# EAGLE design On Board Computer (EAGLE 9.6.2)

## Sheet 1 of 2
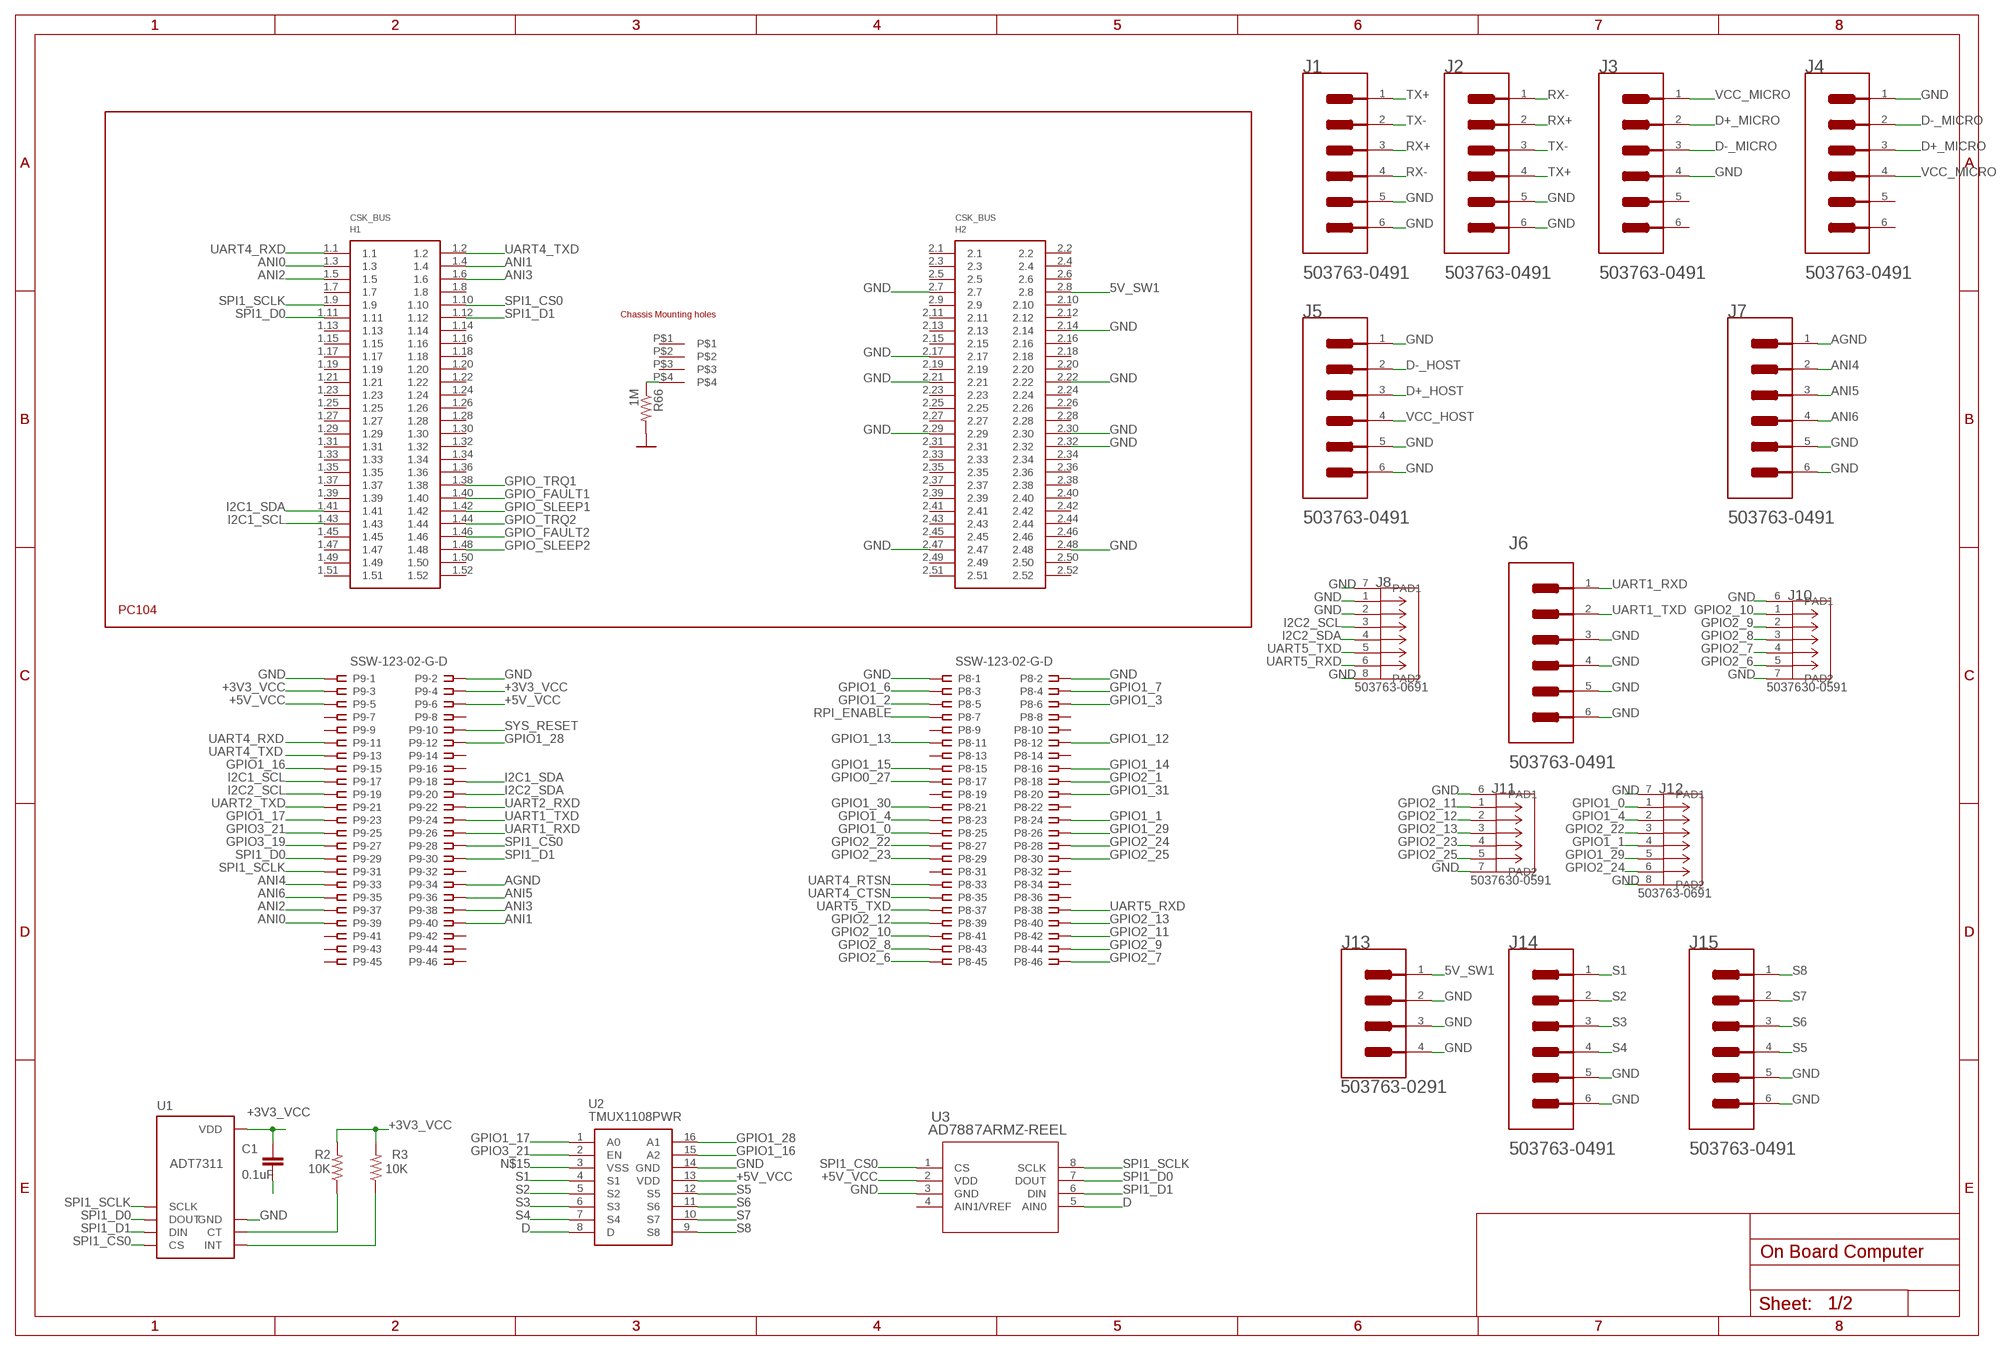
[diagram p0: schematic, sheet 1]

### Parts
C1  0.1uF  CAP0805  [0805]
H1  PC104_WCONN  [PC104_WCONN]
J1  MOLEX_503763-0491MOLEX_503763-0491_0_0  [MOLEX_503763-0491_0]
J2  MOLEX_503763-0491MOLEX_503763-0491_0_0  [MOLEX_503763-0491_0]
J3  MOLEX_503763-0491MOLEX_503763-0491_0_0  [MOLEX_503763-0491_0]
J4  MOLEX_503763-0491MOLEX_503763-0491_0_0  [MOLEX_503763-0491_0]
J5  MOLEX_503763-0491MOLEX_503763-0491_0_0  [MOLEX_503763-0491_0]
J6  MOLEX_503763-0491MOLEX_503763-0491_0_0  [MOLEX_503763-0491_0]
J7  MOLEX_503763-0491MOLEX_503763-0491_0_0  [MOLEX_503763-0491_0]
J8  503763-0691  [CONN_503763-0691_MOL]
J10  503763-0591  [CONN_5037630591_MOL]
J11  503763-0591  [CONN_5037630591_MOL]
J12  503763-0691  [CONN_503763-0691_MOL]
J13  MOLEX_503763-0291MOLEX_503763-0291_0_0  [MOLEX_503763-0291_0]
J14  MOLEX_503763-0491MOLEX_503763-0491_0_0  [MOLEX_503763-0491_0]
J15  MOLEX_503763-0491MOLEX_503763-0491_0_0  [MOLEX_503763-0491_0]
P8  SSW-123-02-G-D  [SSW-123-02-G-D]
P9  SSW-123-02-G-D  [SSW-123-02-G-D]
R2  10K  RESISTOR0805-RES  [0805]
R3  10K  RESISTOR0805-RES  [0805]
R66  1M  RESISTOR0805-RES  [0805]
U1  ADT7311  [SOIC-8]
U2  TMUX1108PWR  [SOP65P640X120-16N]
U3  AD7887ARMZ-REEL  [RM_8_ADI]

### Nets
5V_SW1: H1.2.8 J13.1 ; also sheet 2
+3V3_VCC: C1.1 P9.3 P9.4 R2.2 R3.2 U1.8(VDD) ; also sheet 2
+5V_VCC: P9.5 P9.6 U2.13(VDD) U3.2(VDD)
AGND: J7.1 P9.34
ANI0: H1.1.3 P9.39
ANI1: H1.1.4 P9.40
ANI2: H1.1.5 P9.37
ANI3: H1.1.6 P9.38
ANI4: J7.2 P9.33
ANI5: J7.3 P9.36
ANI6: J7.4 P9.35
D: U2.8(D) U3.5(AIN0)
D+_HOST: J5.3 ; also sheet 2
D+_MICRO: J3.2 J4.3
D-_HOST: J5.2 ; also sheet 2
D-_MICRO: J3.3 J4.2
GND: C1.2 H1.2.7 H1.2.14 H1.2.17 H1.2.21 H1.2.22 H1.2.29 H1.2.30 H1.2.32 H1.2.47 H1.2.48 J1.5(MNT_1) J1.6(MNT_2) J2.5(MNT_1) J2.6(MNT_2) J3.4 J4.1 J5.1 J5.5(MNT_1) J5.6(MNT_2) J6.3 J6.4 J6.5(MNT_1) J6.6(MNT_2) J7.5(MNT_1) J7.6(MNT_2) J8.1 J8.2 J8.7(PAD1) J8.8(PAD2) J10.6(PAD1) J10.7(PAD2) J11.6(PAD1) J11.7(PAD2) J12.7(PAD1) J12.8(PAD2) J13.2 J13.3(MNT_1) J13.4(MNT_2) J14.5(MNT_1) J14.6(MNT_2) J15.5(MNT_1) J15.6(MNT_2) P8.1 P8.2 P9.1 P9.2 R66.2 U1.7(GND) U2.14(GND) U3.3(GND) ; also sheet 2
GPIO0_27: P8.17
GPIO1_0: J12.1 P8.25
GPIO1_1: J12.4 P8.24
GPIO1_2: P8.5
GPIO1_3: P8.6
GPIO1_4: J12.2 P8.23
GPIO1_6: P8.3
GPIO1_7: P8.4
GPIO1_12: P8.12
GPIO1_13: P8.11
GPIO1_14: P8.16
GPIO1_15: P8.15
GPIO1_16: P9.15 U2.15(A2)
GPIO1_17: P9.23 U2.1(A0)
GPIO1_28: P9.12 U2.16(A1)
GPIO1_29: J12.5 P8.26
GPIO1_30: P8.21
GPIO1_31: P8.20
GPIO2_1: P8.18
GPIO2_6: J10.5 P8.45
GPIO2_7: J10.4 P8.46
GPIO2_8: J10.3 P8.43
GPIO2_9: J10.2 P8.44
GPIO2_10: J10.1 P8.41
GPIO2_11: J11.1 P8.42
GPIO2_12: J11.2 P8.39
GPIO2_13: J11.3 P8.40
GPIO2_22: J12.3 P8.27
GPIO2_23: J11.4 P8.29
GPIO2_24: J12.6 P8.28
GPIO2_25: J11.5 P8.30
GPIO3_19: P9.27
GPIO3_21: P9.25 U2.2(EN)
GPIO_FAULT1: H1.1.40
GPIO_FAULT2: H1.1.46
GPIO_SLEEP1: H1.1.42
GPIO_SLEEP2: H1.1.48
GPIO_TRQ1: H1.1.38
GPIO_TRQ2: H1.1.44
I2C1_SCL: H1.1.43 P9.17
I2C1_SDA: H1.1.41 P9.18
I2C2_SCL: J8.3 P9.19
I2C2_SDA: J8.4 P9.20
N$15: U2.3(VSS)
N$94: H1.P$4 R66.1
RPI_ENABLE: P8.7 ; also sheet 2
RX+: J1.3 J2.2
RX-: J1.4 J2.1
S1: J14.1 U2.4(S1)
S2: J14.2 U2.5(S2)
S3: J14.3 U2.6(S3)
S4: J14.4 U2.7(S4)
S5: J15.4 U2.12(S5)
S6: J15.3 U2.11(S6)
S7: J15.2 U2.10(S7)
S8: J15.1 U2.9(S8)
SPI1_CS0: H1.1.10 P9.28 U1.4(CS) U3.1(CS)
SPI1_D0: H1.1.11 P9.29 U1.2(DOUT) U3.7(DOUT)
SPI1_D1: H1.1.12 P9.30 U1.3(DIN) U3.6(DIN)
SPI1_SCLK: H1.1.9 P9.31 U1.1(SCLK) U3.8(SCLK)
SYS_RESET: P9.10
TX+: J1.1 J2.4
TX-: J1.2 J2.3
U11_CT: R2.1 U1.6(CT)
U11_INT: R3.1 U1.5(INT)
UART1_RXD: J6.1 P9.26
UART1_TXD: J6.2 P9.24
UART2_RXD: P9.22 ; also sheet 2
UART2_TXD: P9.21 ; also sheet 2
UART4_CTSN: P8.35
UART4_RTSN: P8.33
UART4_RXD: H1.1.1 P9.11
UART4_TXD: H1.1.2 P9.13
UART5_RXD: J8.6 P8.38
UART5_TXD: J8.5 P8.37
VCC_HOST: J5.4 ; also sheet 2
VCC_MICRO: J3.1 J4.4
Unconnected: H1.1.7 H1.1.8 H1.1.13 H1.1.14 H1.1.15 H1.1.16 H1.1.17 H1.1.18 H1.1.19 H1.1.20 H1.1.21 H1.1.22 H1.1.23 H1.1.24 H1.1.25 H1.1.26 H1.1.27 H1.1.28 H1.1.29 H1.1.30 H1.1.31 H1.1.32 H1.1.33 H1.1.34 H1.1.35 H1.1.36 H1.1.37 H1.1.39 H1.1.45 H1.1.47 H1.1.49 H1.1.50 H1.1.51 H1.1.52 H1.2.1 H1.2.2 H1.2.3 H1.2.4 H1.2.5 H1.2.6 H1.2.9 H1.2.10 H1.2.11 H1.2.12 H1.2.13 H1.2.15 H1.2.16 H1.2.18 H1.2.19 H1.2.20 H1.2.23 H1.2.24 H1.2.25 H1.2.26 H1.2.27 H1.2.28 H1.2.31 H1.2.33 H1.2.34 H1.2.35 H1.2.36 H1.2.37 H1.2.38 H1.2.39 H1.2.40 H1.2.41 H1.2.42 H1.2.43 H1.2.44 H1.2.45 H1.2.46 H1.2.49 H1.2.50 H1.2.51 H1.2.52 H1.P$1 H1.P$2 H1.P$3 J3.5(MNT_1) J3.6(MNT_2) J4.5(MNT_1) J4.6(MNT_2) P8.8 P8.9 P8.10 P8.13 P8.14 P8.19 P8.22 P8.31 P8.32 P8.34 P8.36 P9.7 P9.8 P9.9 P9.14 P9.16 P9.32 P9.41 P9.42 P9.43 P9.44 P9.45 P9.46 U3.4(AIN1/VREF)

## Sheet 2 of 2
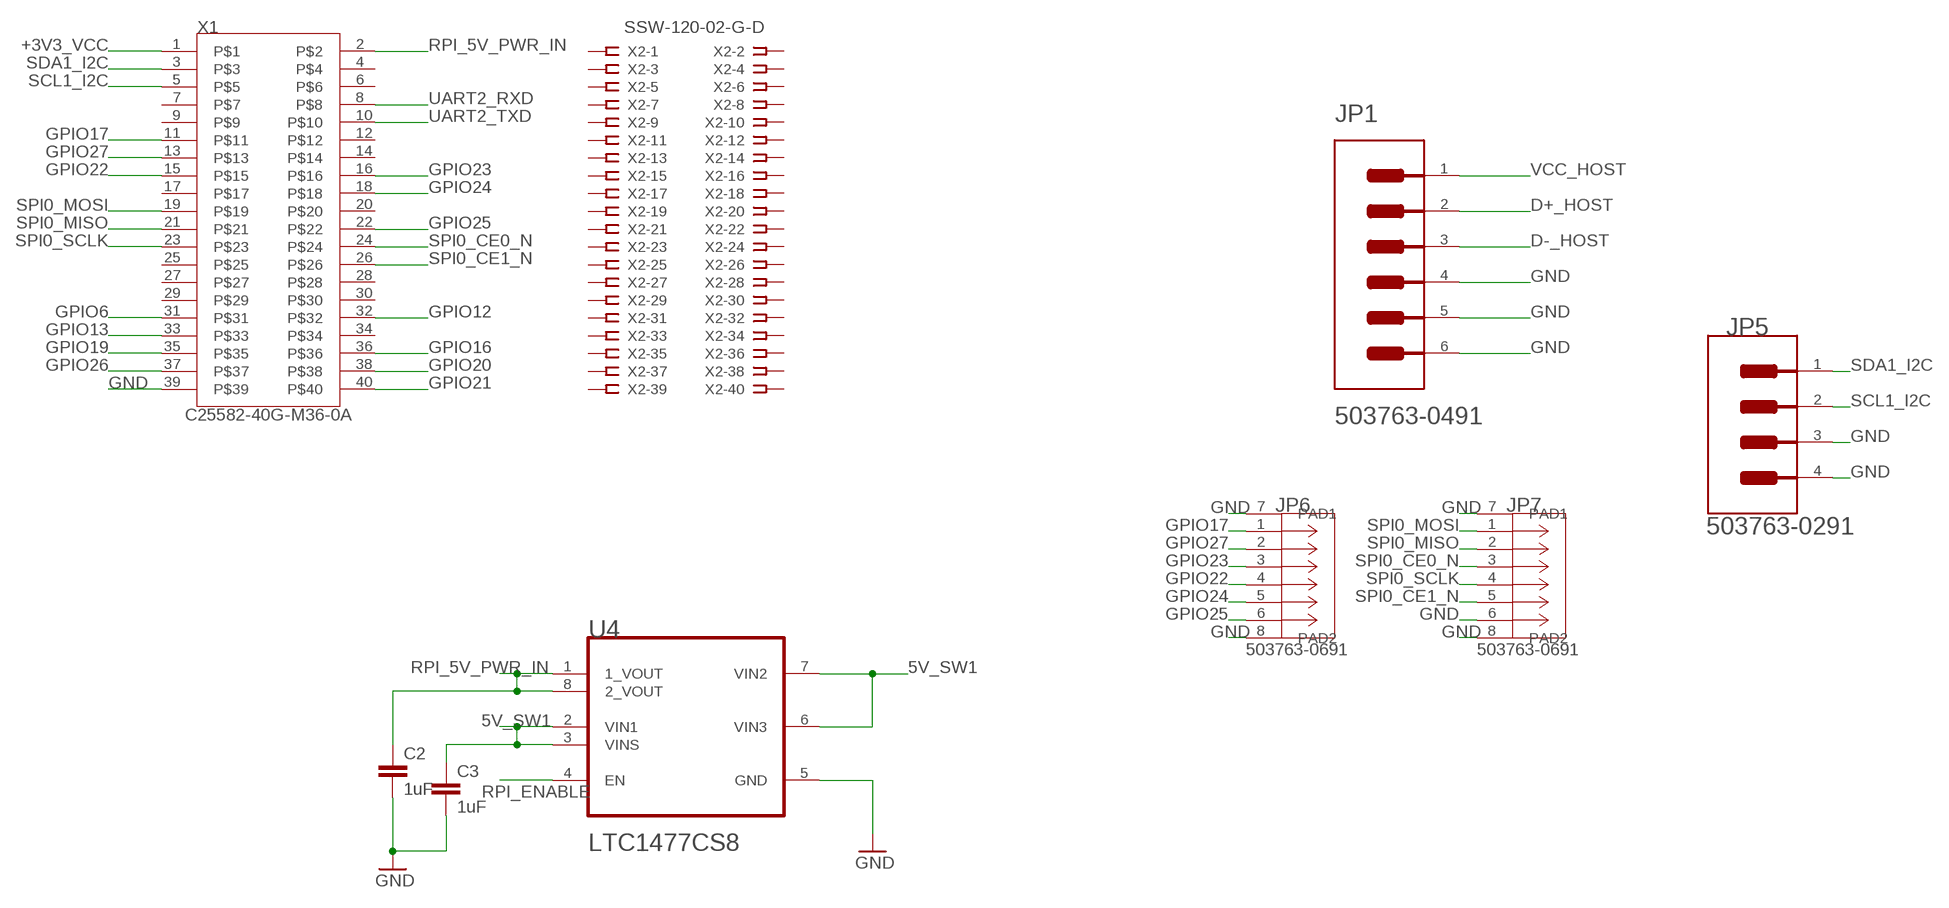
[diagram p1: schematic, sheet 2]

### Parts
C2  1uF  CAP0805  [0805]
C3  1uF  CAP0805  [0805]
JP1  MOLEX_503763-0491MOLEX_503763-0491_0_0  [MOLEX_503763-0491_0]
JP5  MOLEX_503763-0291MOLEX_503763-0291_0_0  [MOLEX_503763-0291_0]
JP6  503763-0691  [CONN_503763-0691_MOL]
JP7  503763-0691  [CONN_503763-0691_MOL]
U4  LTC1477CS8LINEAR_TECHNOLOGY_LTC1477CS8_0_2  [LINEAR_TECHNOLOGY_LTC1477CS8_2]
X1  C25582-40G-M36-0A  [ADAFRUIT_C25582-40G-M36-0A_0]
X2  SSW-120-02-G-D  [SSW-120-02-G-D]

### Nets
5V_SW1: C3.1 U4.2(VIN1) U4.3(VINS) U4.6(VIN3) U4.7(VIN2) ; also sheet 1
+3V3_VCC: X1.1 ; also sheet 1
D+_HOST: JP1.2 ; also sheet 1
D-_HOST: JP1.3 ; also sheet 1
GND: C2.2 C3.2 JP1.4 JP1.5(MNT_1) JP1.6(MNT_2) JP5.3(MNT_1) JP5.4(MNT_2) JP6.7(PAD1) JP6.8(PAD2) JP7.6 JP7.7(PAD1) JP7.8(PAD2) U4.5(GND) X1.39 ; also sheet 1
GPIO6: X1.31
GPIO12: X1.32
GPIO13: X1.33
GPIO16: X1.36
GPIO17: JP6.1 X1.11
GPIO19: X1.35
GPIO20: X1.38
GPIO21: X1.40
GPIO22: JP6.4 X1.15
GPIO23: JP6.3 X1.16
GPIO24: JP6.5 X1.18
GPIO25: JP6.6 X1.22
GPIO26: X1.37
GPIO27: JP6.2 X1.13
RPI_5V_PWR_IN: C2.1 U4.1(1_VOUT) U4.8(2_VOUT) X1.2
RPI_ENABLE: U4.4(EN) ; also sheet 1
SCL1_I2C: JP5.2 X1.5
SDA1_I2C: JP5.1 X1.3
SPI0_CE0_N: JP7.3 X1.24
SPI0_CE1_N: JP7.5 X1.26
SPI0_MISO: JP7.2 X1.21
SPI0_MOSI: JP7.1 X1.19
SPI0_SCLK: JP7.4 X1.23
UART2_RXD: X1.8 ; also sheet 1
UART2_TXD: X1.10 ; also sheet 1
VCC_HOST: JP1.1 ; also sheet 1
Unconnected: X1.4 X1.6 X1.7 X1.9 X1.12 X1.14 X1.17 X1.20 X1.25 X1.27 X1.28 X1.29 X1.30 X1.34 X2.1 X2.2 X2.3 X2.4 X2.5 X2.6 X2.7 X2.8 X2.9 X2.10 X2.11 X2.12 X2.13 X2.14 X2.15 X2.16 X2.17 X2.18 X2.19 X2.20 X2.21 X2.22 X2.23 X2.24 X2.25 X2.26 X2.27 X2.28 X2.29 X2.30 X2.31 X2.32 X2.33 X2.34 X2.35 X2.36 X2.37 X2.38 X2.39 X2.40

## Library data of the parts
C1-C3 = HSFL_Main_Library:CAP: Capacitor Standard 0603 ceramic capacitor, and 0.1" leaded capacitor.
H1 = HSFL_Main_Library:PC104_WCONN
J1-J7 J14 J15 JP1 = Molex - 503763-0491:MOLEX_503763-0491: Wire-To-Board Connector, Pico-Lock 503763 Series, Surface Mount, Header, 4 Contacts, 1 mm; AUTOMOTIVE: No; CENTROID_NOT_SPECIFIED: No; CONN_GENDER: Male; CONN_ORIENTATION: Right Angle; CONTACT_MATERIAL: Gold,Nickel; CURRENT_RATING: 1.5A; DATASHEET: https://www.molex.com/webdocs/datasheets/pdf/en-us/5037630491_PCB_HEADERS.pdf; DEVICE_CLASS_L1: Connectors; DEVICE_CLASS_L2: Headers and Wire Housings; DEVICE_CLASS_L3: unset; DIGIKEY_DESCRIPTION: CONN HEADER 1MM R/A 4CKT; DIGIKEY_PART_NUMBER: WM10655CT-ND; FOOTPRINT_URL: https://www.molex.com/pdm_docs/sd/5037630491_sd.pdf; FOOTPRINT_VARIANT_NAME_0: Recommended_Land_Pattern; HEIGHT: 1.7mm; LEAD_FREE: Yes; MF: Molex; MFG_PACKAGE_IDENT: 503763-0491; MFG_PACKAGE_IDENT_DATE: 0; MFG_PACKAGE_IDENT_REV: 0; MOUSER_PART_NUMBER: 538-503763-0491; MPN: 503763-0491; NUMBER_OF_CONTACTS: 4; NUMBER_OF_ROWS: 1; PACKAGE: HDR4; PITCH: 1mm; PREFIX: J; ROHS: Yes; TEMPERATURE_RANGE_HIGH: +105°C; TEMPERATURE_RANGE_LOW: -40°C; VERIFICATION_VERSION: 0.0.0.1; VOLTAGE_RATING: 150V
J8 J12 JP6 JP7 = Improved Molex 503763-0691:503763-0691; BUILT_BY: EMA_Cory; COPYRIGHT: Copyright (C) 2018 Accelerated Designs. All rights reserved; DATASHEET: https://www.digikey.com/products/en?keywords=503763-0691; MANUFACTURER_PART_NUMBER: 503763-0691; SOURCELIBRARY: Molex_2020-01-22; VENDOR: Molex Connector Corporation
J10 J11 = Improved Molex 503763-0591:503763-0591; BUILT_BY: EMA_Cory; COPYRIGHT: Copyright (C) 2018 Accelerated Designs. All rights reserved; DATASHEET: https://www.molex.com/pdm_docs/sd/5037630591_sd.pdf; MANUFACTURER_PART_NUMBER: 503763-0591; SOURCELIBRARY: Add_to_database_2020-12-14; VENDOR: Molex Connector Corporation
J13 JP5 = Molex - 503763-0291:MOLEX_503763-0291: 2 Positions Header Connector 0.039" (1.00mm) Surface Mount, Right Angle Gold; CENTROID_NOT_SPECIFIED: No; DATASHEET: http://www.molex.com/pdm_docs/sd/5037630291_sd.pdf; DIGIKEY_DESCRIPTION: CONN HEADER 1MM R/A 2CKT; DIGIKEY_PART_NUMBER: WM10654CT-ND; LEAD_FREE: yes; MF: Molex; MOUSER_PART_NUMBER: 538-503763-0291; MPN: 503763-0291; PACKAGE: HDR02; PREFIX: J; ROHS: yes; TEMPERATURE_RANGE_HIGH: +105°C; TEMPERATURE_RANGE_LOW: -40°C
P8 P9 = con-samtec:SSW-123-02-G: THROUGH-HOLE .025" SQ POST SOCKET Source: Samtec SSW.pdf; MF: Samtec Inc.; MPN: SSW-123-02-G-D; OC_FARNELL: unknown; OC_NEWARK: 11P9690
R2 R3 R66 = HSFL_Main_Library:RESISTOR: Resistor Basic schematic elements and footprints for 0603, 1206, and PTH resistors.
U1 = HSFL_Main_Library:ADT7311: The ADT7311 is a high accuracy digital temperature sensor in a narrow 8-lead SOIC package. It contains a band gap temperature reference and a 16-bit ADC to monitor and digitize the temperature to a 0.0078°C resolution. The ADC resolution, by default, is set to 13 bits (0.0625°C). The ADC resolution is a user programmable mode that can be changed through the serial interface. br> The ADT7311 is guaranteed to operate over supply voltages from 2.7 V to 5.5 V. Operating at 3.3 V, the average supply current is typically 210 μA. The ADT7311 has a shutdown mode that powers down the device and offers a shutdown current of typically 2 μA. The ADT7311 is rated for operation over the −40°C to +150°C temperature range. br> The CT pin is an open-drain output that becomes active when the temperature exceeds a programmable critical temperature limit. The default critical temperature limit is 147°C. The INT pin is also an open-drain output that becomes active when the temperature exceeds a programmable limit. The INT and CT pins can operate in either comparator or interrupt mode.
U2 = SamacSys_Parts:TMUX1108PWR: Analog Switch ICs 5V / +/-2.5V, 8:1, low-leakage precision multiplexer 16-TSSOP -40 to 125 Source: Datasheet <http://www.ti.com/lit/ds/symlink/tmux1108.pdf>; DESCRIPTION: Analog Switch ICs 5V / +/-2.5V, 8:1, low-leakage precision multiplexer 16-TSSOP -40 to 125; HEIGHT: 1.2mm; MANUFACTURER_NAME: Texas Instruments; MANUFACTURER_PART_NUMBER: TMUX1108PWR; MOUSER_PART_NUMBER: 595-TMUX1108PWR; MOUSER_PRICE-STOCK: https://www.mouser.co.uk/ProductDetail/Texas-Instruments/TMUX1108PWR?qs=PqoDHHvF6486MXIgK4oQ5g%3D%3D
U3 = Personal:AD7887ARMZ-REEL; BUILT_BY: EMA_UL_Team; MANUFACTURER_PART_NUMBER: AD7887ARMZ-REEL; SOURCELIBRARY: Analog_2012-01-01_5; VENDOR: Analog Devices Inc
U4 = Artemis:LTC1477CS8: LT-LTC1477-S8-8; CIIVA_IDS: 1432281; COMPONENT_LINK_1_DESCRIPTION: Manufacturer URL; COMPONENT_LINK_1_URL: http://www.linear.com/; COMPONENT_LINK_3_DESCRIPTION: Package Specification; COMPONENT_LINK_3_URL: http://cds.linear.com/docs/en/packaging/05081610_G_SO8.pdf; DATASHEET: http://cds.linear.com/docs/en/datasheet/lt1477.pdf; FOOTPRINT_VARIANT_NAME_0: Level C; FOOTPRINT_VARIANT_NAME_1: Level B; FOOTPRINT_VARIANT_NAME_2: Level A; IMPORTED: yes; IMPORTED_FROM: vault; IMPORT_TS: 1521843574; MF: Linear Technology; MOUNTING_TECHNOLOGY: Surface Mount; MPN: LTC1477CS8; PACKAGE: S8-8; PACKAGE_DESCRIPTION: 8-Pin Plastic Small Outline (Narrow .150 Inch), Body 4.9 x 3.9 mm, Pitch 1.27 mm; PACKAGE_VERSION: Rev. G, 03/2012; PREFIX: U; RELEASE_DATE: 1377817843; ROHS: No; VAULT_GUID: 635B2D7C-EC07-409E-A57F-666E02CD64AC; VAULT_REVISION: 6B8B57C2-2CB3-4970-A31A-1EB58B636423
X1 = Adafruit - C25582-40G-M36-0A:C25582-40G-M36-0A
X2 = con-samtec:SSW-120-02-G: THROUGH-HOLE .025" SQ POST SOCKET Source: Samtec SSW.pdf; MF: Samtec Inc.; MPN: SSW-120-02-G-D; OC_FARNELL: unknown; OC_NEWARK: 11P9639

## Board
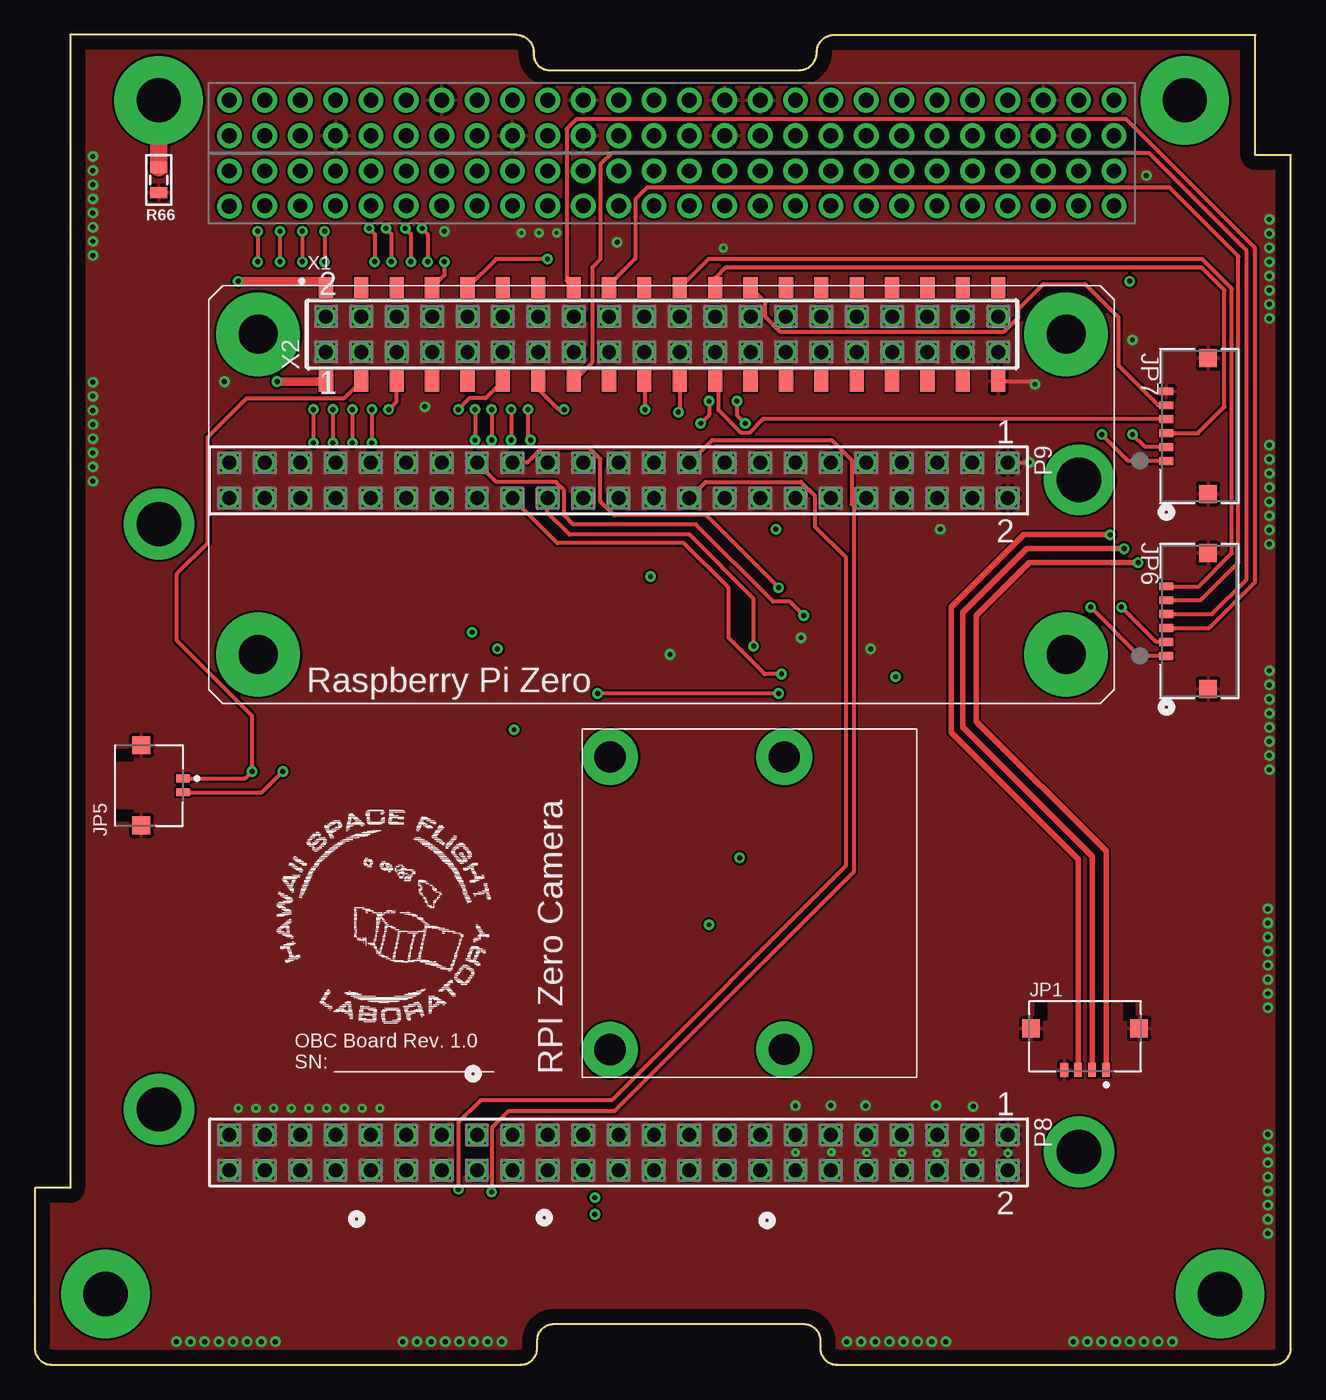
[diagram p2: board, top side]
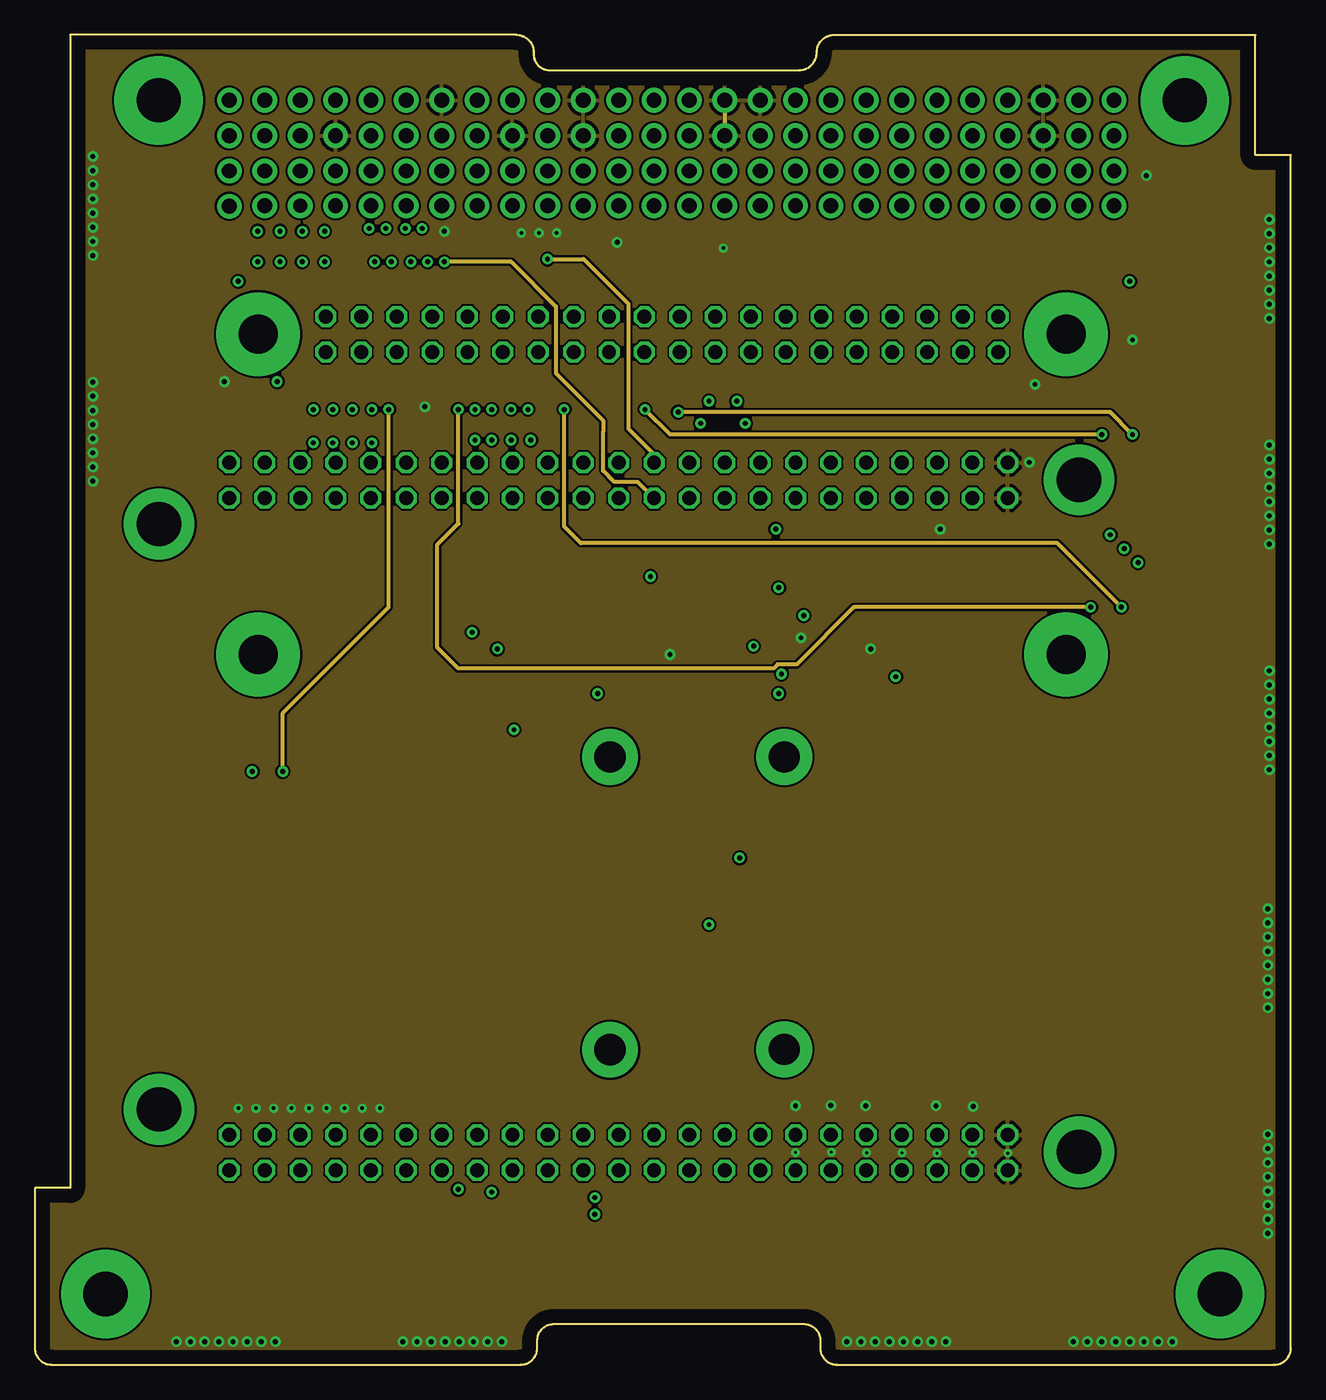
[diagram p3: board, inner layer Route2]
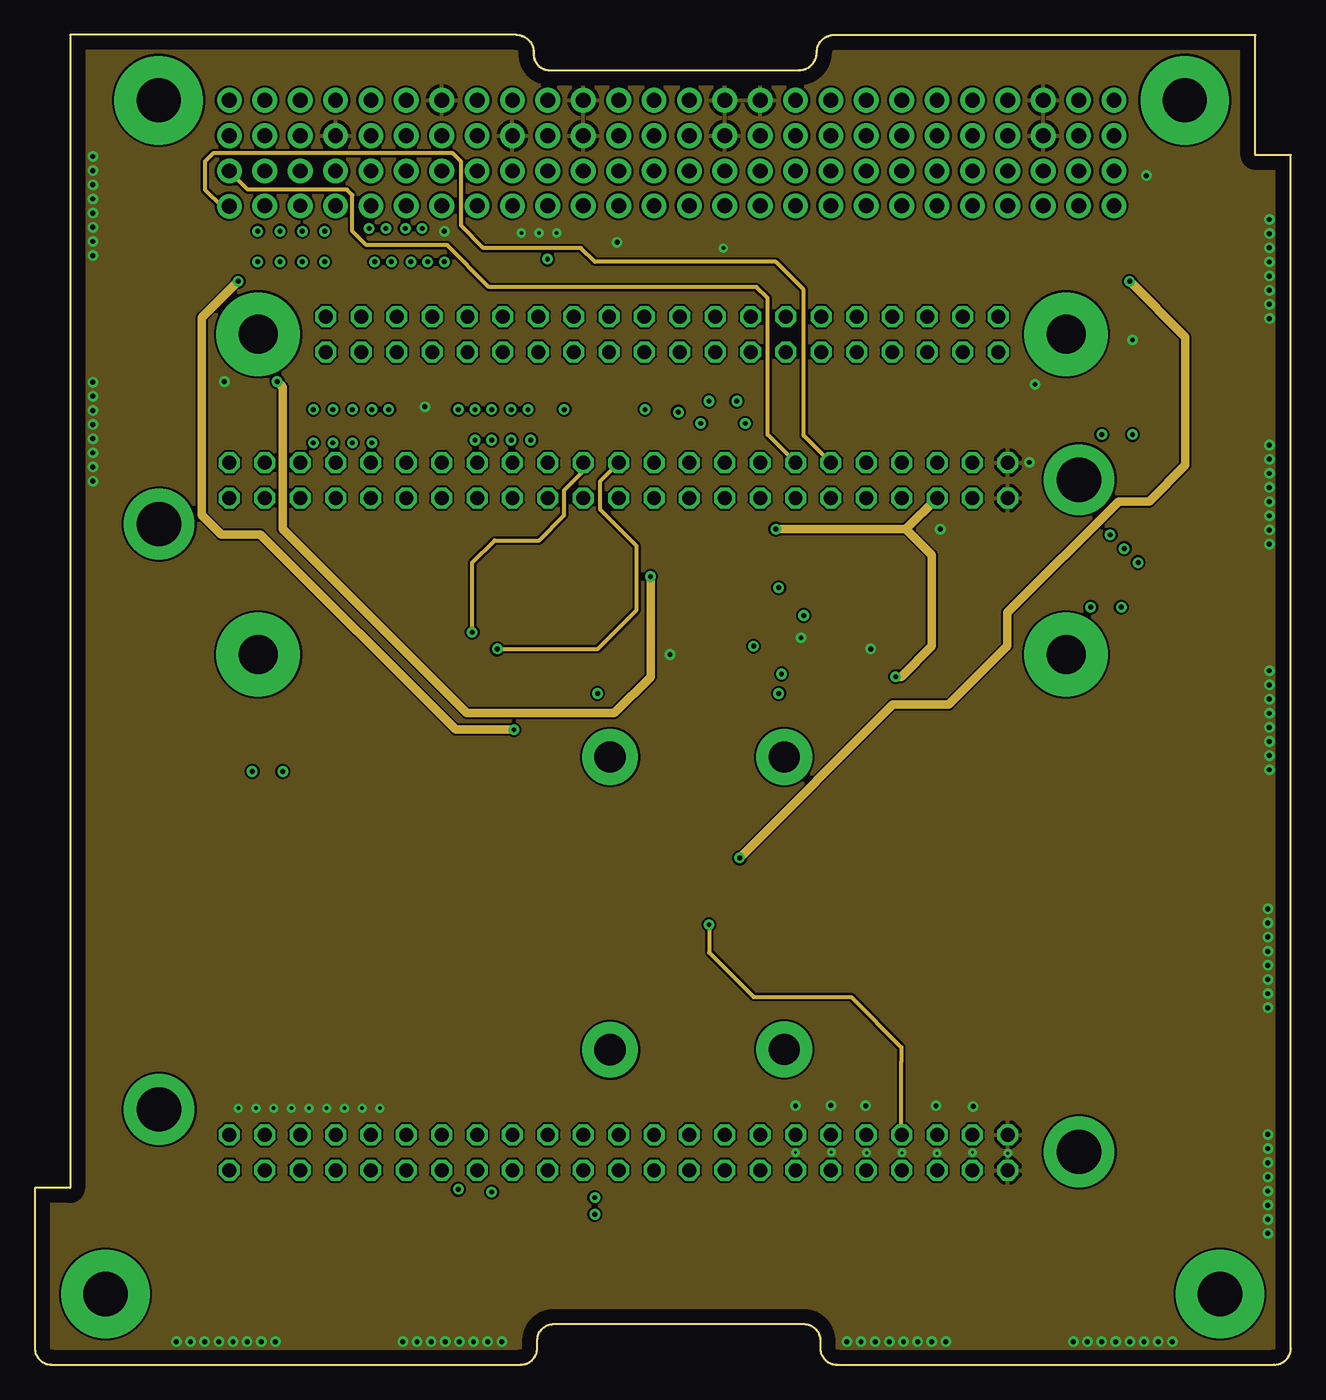
[diagram p4: board, inner layer Route15]
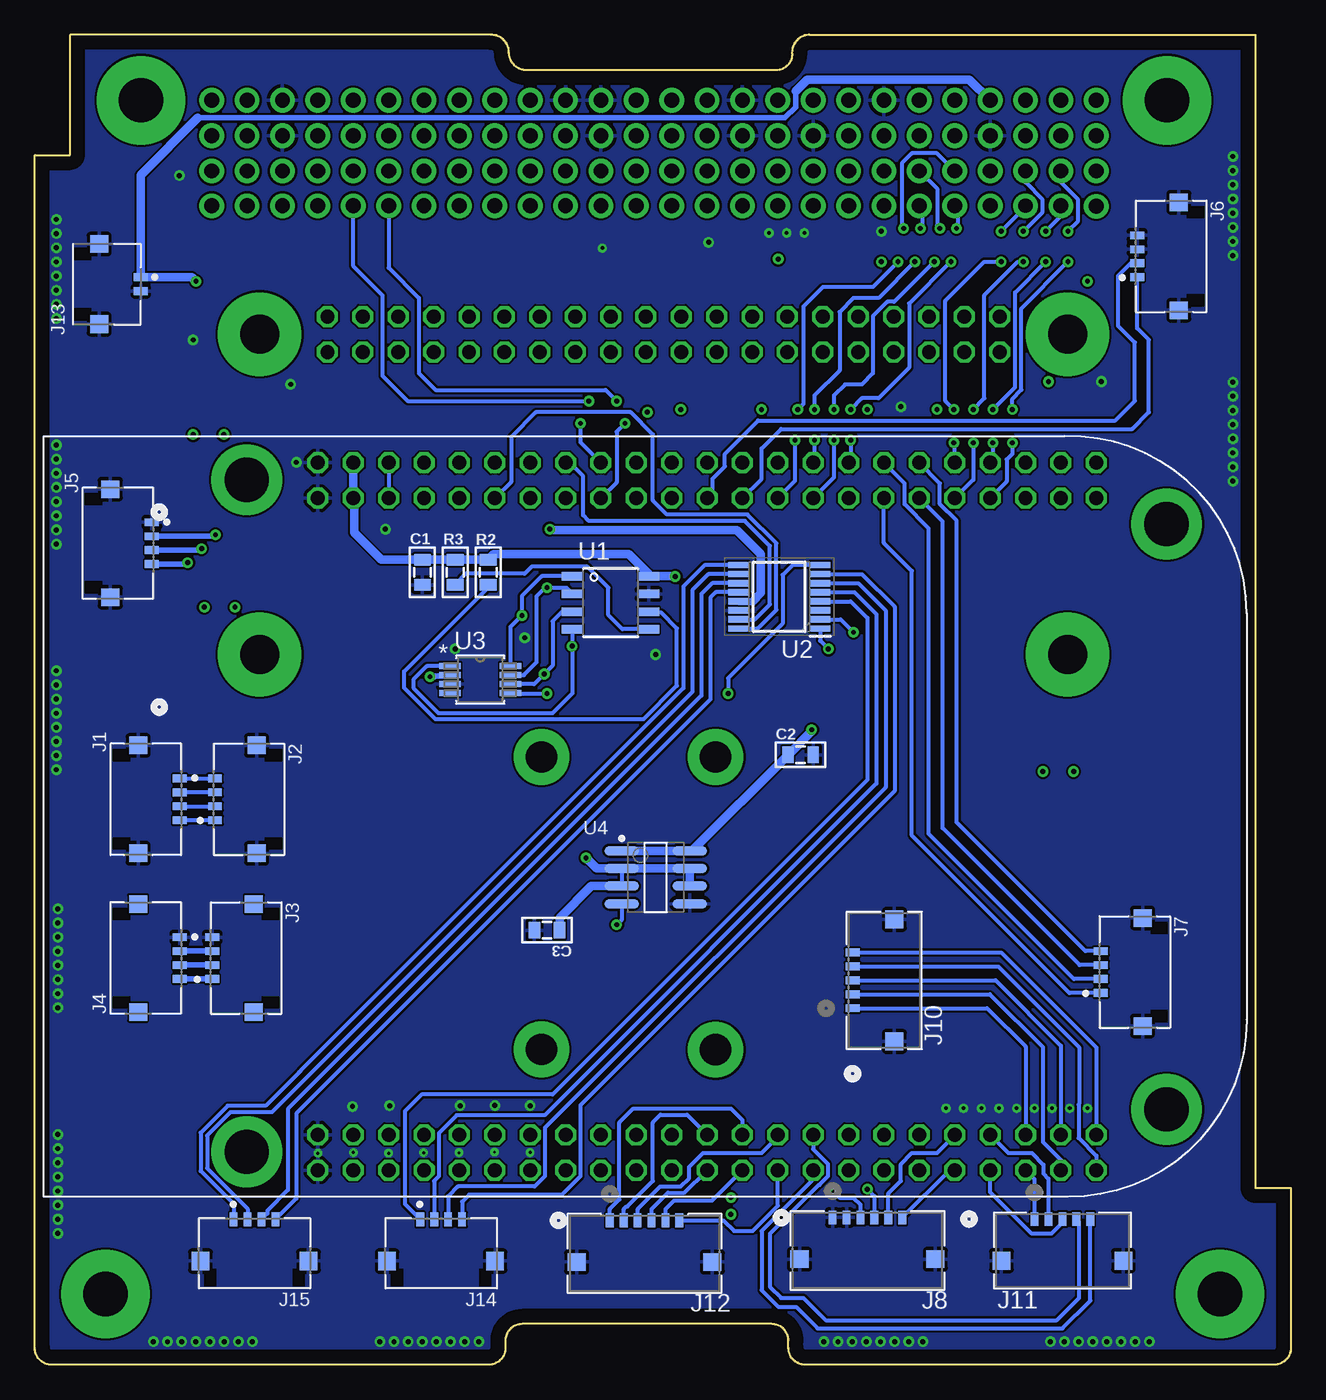
[diagram p5: board, bottom side, seen from below]

Size 90.17 x 95.5 mm. Coordinates in mm from the lower left corner, seen from the top.
Copper layers (1+2*15+16): Top 0.035mm / dielectric 1.5mm / Route2 0.035mm / dielectric 0.15mm / Route15 0.035mm / dielectric 0.2mm / Bottom 0.035mm
Design rules "default *": minimum track width 6mil, minimum drill 8mil, track to track 6mil, track to pad 6mil, pad to pad 6mil, via to via 6mil, smd to smd 6mil, copper to edge 40mil, drill to drill 6mil, minimum pad ring 10mil, minimum via ring 8mil, stop-mask expansion 4mil, vias tented up to drill 0mil, thermal gap 10mil

### Footprints (pad centres in the part's own frame; a part is rotated, then mirrored left to right if it is on the bottom)
0805 = smd 0.8 x 1.2: 1 -0.9,0; 2 0.9,0
PC104_WCONN = drill 1.067 pad 1.778: 1.1 13.97,83.185; 1.2 13.97,85.725; 1.3 16.51,83.223; 1.4 16.51,85.725; 1.6 19.05,85.725; 1.7 21.59,83.223; 1.8 21.59,85.725; 1.9 24.13,83.223; 1.10 24.13,85.725; 1.11 26.67,83.223; 1.12 26.67,85.725; 1.13 29.21,83.223; 1.14 29.21,85.725; 1.15 31.75,83.223; 1.16 31.75,85.725; 1.17 34.29,83.223; 1.18 34.29,85.725; 1.19 36.83,83.223; 1.20 36.83,85.725; 1.21 39.37,83.223; 1.22 39.37,85.725; 1.23 41.91,83.223; 1.24 41.91,85.725; 1.25 44.45,83.223; 1.26 44.45,85.725; 1.27 46.99,83.223; 1.28 46.99,85.725; 1.29 49.53,83.223; 1.30 49.53,85.725; 1.31 52.07,83.223; 1.32 52.07,85.725; 1.33 54.61,83.223; 1.34 54.61,85.725; 1.35 57.15,83.223; 1.36 57.15,85.725; 1.37 59.69,83.223; 1.38 59.69,85.725; 1.39 62.23,83.223; 1.40 62.23,85.725; 1.41 64.77,83.223; 1.42 64.77,85.725; 1.43 67.31,83.223; 1.44 67.31,85.725; 1.45 69.85,83.223; 1.46 69.85,85.725; 1.47 72.39,83.223; 1.48 72.39,85.725; 1.49 74.93,83.223; 1.50 74.93,85.725; 1.51 77.47,83.223; 1.52 77.47,85.725; 2.1 13.97,88.265; 2.2 13.97,90.805; 2.3 16.51,88.265; 2.4 16.51,90.805; 2.5 19.05,88.265; 2.6 19.05,90.805; 2.7 21.59,88.265; 2.8 21.59,90.805; 2.9 24.13,88.265; 2.10 24.13,90.805; 2.11 26.67,88.265; 2.12 26.67,90.805; 2.13 29.21,88.265; 2.14 29.21,90.805; 2.15 31.75,88.265; 2.16 31.75,90.805; 2.17 34.29,88.265; 2.18 34.29,90.805; 2.19 36.83,88.265; 2.20 36.83,90.805; 2.21 39.37,88.265; 2.22 39.37,90.805; 2.23 41.91,88.265; 2.24 41.91,90.805; 2.25 44.45,88.265; 2.26 44.45,90.805; 2.27 46.99,88.265; 2.28 46.99,90.805; 2.29 49.53,88.265; 2.30 49.53,90.805; 2.31 52.07,88.265; 2.32 52.07,90.805; 2.33 54.61,88.265; 2.34 54.61,90.805; 2.35 57.15,88.265; 2.36 57.15,90.805; 2.37 59.69,88.265; 2.38 59.69,90.805; 2.39 62.23,88.265; 2.40 62.23,90.805; 2.41 64.77,88.265; 2.42 64.77,90.805; 2.43 67.31,88.265; 2.44 67.31,90.805; 2.45 69.85,88.265; 2.46 69.85,90.805; 2.47 72.39,88.265; 2.48 72.39,90.805; 2.49 74.93,88.265; 2.50 74.93,90.805; 2.51 77.47,88.265; 2.52 77.47,90.805 | drill 1.016 pad 1.778: 1.5 19.05,83.223 | drill 3.175 pad 6.35: P$1 5.08,5.08; P$2 85.09,5.08; P$3 82.55,90.805; P$4 8.89,90.805
MOLEX_503763-0491_0 = smd 0.55 x 1: 1 1.5,-2.435; 2 0.5,-2.435; 3 -0.5,-2.435; 4 -1.5,-2.435 | smd 1.26 x 1.3: 5 -3.875,0.555; 6 3.875,0.555
CONN_503763-0691_MOL = smd 0.559 x 0.991: 1 2.5,-2.368; 2 1.5,-2.368; 3 0.5,-2.368; 4 -0.5,-2.368; 5 -1.5,-2.368; 6 -2.5,-2.368 | smd 1.295 x 1.27: 7 -4.875,0.622; 8 4.875,0.622
CONN_5037630591_MOL = smd 0.559 x 0.991: 1 -2,2.261; 2 -1,2.261; 3 0,2.261; 4 1,2.261; 5 2,2.261 | smd 1.27 x 1.295: 6 -4.375,-0.729; 7 4.375,-0.729
MOLEX_503763-0291_0 = smd 0.55 x 1: 1 0.5,-2.435; 2 -0.5,-2.435 | smd 1.26 x 1.3: 3 -2.875,0.555; 4 2.875,0.555
SSW-123-02-G-D = drill 1 pad 1.5 octagon: 1 -27.94,-1.27; 2 -27.94,1.27; 3 -25.4,-1.27; 4 -25.4,1.27; 5 -22.86,-1.27; 6 -22.86,1.27; 7 -20.32,-1.27; 8 -20.32,1.27; 9 -17.78,-1.27; 10 -17.78,1.27; 11 -15.24,-1.27; 12 -15.24,1.27; 13 -12.7,-1.27; 14 -12.7,1.27; 15 -10.16,-1.27; 16 -10.16,1.27; 17 -7.62,-1.27; 18 -7.62,1.27; 19 -5.08,-1.27; 20 -5.08,1.27; 21 -2.54,-1.27; 22 -2.54,1.27; 23 0,-1.27; 24 0,1.27; 25 2.54,-1.27; 26 2.54,1.27; 27 5.08,-1.27; 28 5.08,1.27; 29 7.62,-1.27; 30 7.62,1.27; 31 10.16,-1.27; 32 10.16,1.27; 33 12.7,-1.27; 34 12.7,1.27; 35 15.24,-1.27; 36 15.24,1.27; 37 17.78,-1.27; 38 17.78,1.27; 39 20.32,-1.27; 40 20.32,1.27; 41 22.86,-1.27; 42 22.86,1.27; 43 25.4,-1.27; 44 25.4,1.27; 45 27.94,-1.27; 46 27.94,1.27
SOIC-8 = smd 1.524 x 0.61: 1 -2.68,1.855; 2 -2.68,0.585; 3 -2.68,-0.685; 4 -2.68,-1.955; 5 2.78,-1.955; 6 2.78,-0.685; 7 2.78,0.585; 8 2.78,1.855
SOP65P640X120-16N = smd 1.475 x 0.45: 1 -2.938,2.275; 2 -2.938,1.625; 3 -2.938,0.975; 4 -2.938,0.325; 5 -2.938,-0.325; 6 -2.938,-0.975; 7 -2.938,-1.625; 8 -2.938,-2.275; 9 2.938,-2.275; 10 2.938,-1.625; 11 2.938,-0.975; 12 2.938,-0.325; 13 2.938,0.325; 14 2.938,0.975; 15 2.938,1.625; 16 2.938,2.275
RM_8_ADI = smd 1.524 x 0.432: 1 -2.172,0.975; 2 -2.172,0.325; 3 -2.172,-0.325; 4 -2.172,-0.975; 5 2.172,-0.975; 6 2.172,-0.325; 7 2.172,0.325; 8 2.172,0.975
LINEAR_TECHNOLOGY_LTC1477CS8_2 = smd 2.5 x 0.7: 1 -2.45,1.905; 2 -2.45,0.635; 3 -2.45,-0.635; 4 -2.45,-1.905; 5 2.45,-1.905; 6 2.45,-0.635; 7 2.45,0.635; 8 2.45,1.905
ADAFRUIT_C25582-40G-M36-0A_0 = smd 1.02 x 1.524: 1 -24.13,-3.354; 2 -24.13,3.354; 3 -21.59,-3.354; 4 -21.59,3.354; 5 -19.05,-3.354; 6 -19.05,3.354; 7 -16.51,-3.354; 8 -16.51,3.354; 9 -13.97,-3.354; 10 -13.97,3.354; 11 -11.43,-3.354; 12 -11.43,3.354; 13 -8.89,-3.354; 14 -8.89,3.354; 15 -6.35,-3.354; 16 -6.35,3.354; 17 -3.81,-3.354; 18 -3.81,3.354; 19 -1.27,-3.354; 20 -1.27,3.354; 21 1.27,-3.354; 22 1.27,3.354; 23 3.81,-3.354; 24 3.81,3.354; 25 6.35,-3.354; 26 6.35,3.354; 27 8.89,-3.354; 28 8.89,3.354; 29 11.43,-3.354; 30 11.43,3.354; 31 13.97,-3.354; 32 13.97,3.354; 33 16.51,-3.354; 34 16.51,3.354; 35 19.05,-3.354; 36 19.05,3.354; 37 21.59,-3.354; 38 21.59,3.354; 39 24.13,-3.354; 40 24.13,3.354
SSW-120-02-G-D = drill 1 pad 1.5 octagon: 1 -24.13,-1.27; 2 -24.13,1.27; 3 -21.59,-1.27; 4 -21.59,1.27; 5 -19.05,-1.27; 6 -19.05,1.27; 7 -16.51,-1.27; 8 -16.51,1.27; 9 -13.97,-1.27; 10 -13.97,1.27; 11 -11.43,-1.27; 12 -11.43,1.27; 13 -8.89,-1.27; 14 -8.89,1.27; 15 -6.35,-1.27; 16 -6.35,1.27; 17 -3.81,-1.27; 18 -3.81,1.27; 19 -1.27,-1.27; 20 -1.27,1.27; 21 1.27,-1.27; 22 1.27,1.27; 23 3.81,-1.27; 24 3.81,1.27; 25 6.35,-1.27; 26 6.35,1.27; 27 8.89,-1.27; 28 8.89,1.27; 29 11.43,-1.27; 30 11.43,1.27; 31 13.97,-1.27; 32 13.97,1.27; 33 16.51,-1.27; 34 16.51,1.27; 35 19.05,-1.27; 36 19.05,1.27; 37 21.59,-1.27; 38 21.59,1.27; 39 24.13,-1.27; 40 24.13,1.27

### Placement (x,y rotation side)
C1  62.35,56.91 270 bottom
C2  35.2,43.8 0 bottom
C3  53.4,31.2 180 bottom
H1  0,0 0 top
J1  82.2,40.6 90 bottom
J2  74.8,40.6 270 bottom
J3  75,29.2 270 bottom
J4  82.2,29.2 90 bottom
J5  84.2,59 90 bottom
J6  8.6,79.6 270 bottom
J7  11.2,28.2 270 bottom
J8  30.4,8.2 180 bottom
J10  29.2,27.6 90 bottom
J11  16.4,8.2 0 bottom
J12  46.4,8 180 bottom
J13  85,77.6 90 bottom
J14  61,8 180 bottom
J15  74.4,8 180 bottom
JP1  75.4,23.6 0 top
JP5  8.2,41.6 90 top
JP6  83.6,53.4 270 top
JP7  83.6,67.4 270 top
P8  41.91,15.24 180 top
P9  41.91,63.5 180 top
R2  57.62,56.91 90 bottom
R3  59.99,56.91 90 bottom
R66  8.89,85.07 270 top
U1  48.89,54.77 0 bottom
U2  36.73,55.15 180 bottom
U3  58.19,49.2 0 bottom
U4  45.6,35 0 bottom
X1  45.03,74 0 top
X2  45.03,74 0 top

### Tracks (layer width: path | path; a pad name or v marks a point on that pad's centre or on a via)
5V_SW1  (via drill 0.35)
  Route15 0.61: v50.6,36.4 61.6,47.4 65.6,47.4 69.8,51.6 69.8,54 77.8,62 80,62 82.6,64.6 82.6,73.8 v78.6,77.8
  Bottom 0.305: U4.2 U4.3
  Bottom 0.406: 35.56,91.44 35.56,90.31 36.33,89.54 78.46,89.54
  Bottom 0.61: H1.2.8 23.08,92.29 34.71,92.29 35.56,91.44 | 78.46,89.54 82.56,85.44 J13.1 78.9,78.1 v78.6,77.8 | U4.3 50.23,34.37 52.5,32.1 C3.1 | U4.6 U4.7 U4.2 49.84,35.63 v50.6,36.4
+3V3_VCC  (via drill 0.35)
  Top 0.305: X1.1 20.86,70.6
  Top 0.61: 20.86,70.6 v17.4,70.6
  Route15 0.61: v17.4,70.6 17.8,70.2 17.8,60 31,46.8 41.6,46.8 44.2,49.4 v44.2,56.6
  Bottom 0.305: 46.11,56.79 U1.8 | P9.4 67.24,62.16 | v44.2,56.6 44.23,56.63
  Bottom 0.61: 67.24,62.16 67.24,59.76 65.29,57.81 C1.1 R3.2 R2.2 57.22,58.21 47.52,58.21 46.11,56.79 | P9.3 P9.4 | 44.23,56.63 U1.8
+5V_VCC  (via drill 0.35)
  Route15 0.61: v53.2,60 62.54,60 | 62.54,60 P9.6 | 62.54,60 64.4,58.14 64.4,51.6 62.2,49.4 v61.8,49.4
  Bottom 0.305: P9.5 P9.6
  Bottom 0.406: v61.8,49.4 61.48,49.4 61.48,49.45 60.37,49.45 U3.2
  Bottom 0.508: U2.13 38.63,54.82
  Bottom 0.61: 38.63,54.82 38.06,55.4 38.06,58.21 39.79,59.94 53.14,59.94 v53.2,60
AGND
  Bottom 0.305: P9.34 29.21,59.01 27.2,57 27.2,38 15.9,26.7 J7.1
ANI0  (via drill 0.35)
  Top 0.305: v17.6,81.4 v17.6,79.2 | v21.4,68.6 v21.4,66.2
  Bottom 0.305: v21.4,68.6 19.8,70.2 19.8,77 v17.6,79.2 | H1.1.3 16.51,82.49 v17.6,81.4 | v21.4,66.2 21.4,64.96 P9.39
ANI1  (via drill 0.35)
  Top 0.305: v16,81.4 v16,79.2 | v20,68.6 v20,66.2
  Bottom 0.305: v20,68.6 20,69.35 19.34,70.01 19.34,75.86 v16,79.2 | H1.1.4 16.51,84.91 15.32,83.72 15.32,82.08 v16,81.4 | v20,66.2 20,65.4 20.4,65 20.4,63.42 P9.40
ANI2  (via drill 0.35)
  Top 0.305: v20.8,81.4 v20.8,79.2 | v24.2,68.6 v24.2,66.2
  Bottom 0.305: v24.2,68.6 24.8,69.2 24.8,76.4 22,79.2 v20.8,79.2 | H1.1.5 19.05,83.15 v20.8,81.4 | P9.37 24.13,66.13 v24.2,66.2
ANI3  (via drill 0.35)
  Top 0.305: v19.2,81.4 v19.2,79.2 | v22.8,68.6 v22.8,66.2
  Bottom 0.305: v22.8,68.6 22,69.4 22,76.8 19.6,79.2 v19.2,79.2 | H1.1.6 19.05,84.91 17.86,83.72 17.86,82.73 19.18,81.4 v19.2,81.4 | v22.8,66.2 22.8,63.56 P9.38
ANI4
  Bottom 0.305: J7.2 15.57,27.7 26,38.13 26,60.06 27.73,61.79 27.73,63.29 P9.33
ANI5
  Bottom 0.305: J7.3 15.16,28.7 25,38.54 25,60.56 P9.36
ANI6
  Bottom 0.305: J7.4 14.74,29.7 24,38.95 24,60.6 25.19,61.79 25.19,63.29 P9.35
D  (via drill 0.35)
  Top 0.305: v53.4,48.2 v40.4,48.2
  Bottom 0.305: U3.5 56,48.2 v53.4,48.2 | U2.8 35.78,57.42 36.49,56.71 36.49,53.22 40.4,49.31 v40.4,48.2
D+_HOST  (via drill 0.35)
  Top 0.406: JP1.2 75.9,36.5 66.6,45.8 66.6,54 71.2,58.6 v78.2,58.6
  Bottom 0.406: J5.3 78.3,58.5 v78.2,58.6
D+_MICRO
  Bottom 0.406: J4.3 J3.2
D-_HOST  (via drill 0.35)
  Top 0.406: JP1.3 74.9,36.3 65.8,45.4 65.8,54.4 71,59.6 v77.2,59.6
  Bottom 0.406: J5.2 77.3,59.5 v77.2,59.6
D-_MICRO
  Bottom 0.406: J3.3 J4.2
GND  (via drill 0.2 pad 0.41, 0.25, 0.35)
  Top 0.305: X1.39 71.56,70.64 v71.8,70.4 | P9.1 69.88,64.8 v71.4,64.8
  Route2 0.305: H1.2.30 H1.2.29
  other vias: 54.61,18.59 57.15,18.62 59.64,18.59 64.69,18.59 67.36,18.54 10.16,1.65 12.19,1.65 13.21,1.65 14.22,1.65 15.24,1.65 16.26,1.65 17.27,1.65 11.18,1.65 26.42,1.65 27.43,1.65 28.45,1.65 29.46,1.65 30.48,1.65 31.5,1.65 32.51,1.65 33.53,1.65 4.17,79.65 4.17,81.69 4.17,82.7 4.17,83.72 4.17,84.73 4.17,85.75 4.17,86.77 4.17,80.67 4.17,63.45 4.17,65.48 4.17,66.5 4.17,67.51 4.17,68.53 4.17,69.55 4.17,70.56 4.17,64.47 58.29,1.65 60.33,1.65 61.34,1.65 62.36,1.65 63.37,1.65 64.39,1.65 65.41,1.65 59.31,1.65 74.55,1.65 75.56,1.65 76.58,1.65 77.6,1.65 78.61,1.65 79.63,1.65 80.64,1.65 81.66,1.65 14.61,18.41 15.88,18.41 17.14,18.41 18.41,18.41 19.68,18.41 20.95,18.41 22.23,18.41 23.5,18.41 24.77,18.41 54.61,15.24 34.92,81.28 36.2,81.28 37.47,81.28 49.43,80.19 88.52,25.63 88.52,27.66 88.52,28.68 88.52,29.69 88.52,30.71 88.52,31.72 88.52,32.74 88.52,26.64 88.52,9.42 88.52,11.46 88.52,12.47 88.52,13.49 88.52,14.5 88.52,15.52 88.52,16.54 88.52,10.44 88.62,58.93 88.62,60.96 88.62,61.98 88.62,62.99 88.62,64.01 88.62,65.02 88.62,66.04 88.62,59.94 88.62,42.72 88.62,44.75 88.62,45.77 88.62,46.79 88.62,47.8 88.62,48.82 88.62,49.83 88.62,43.74 88.62,75.13 88.62,77.17 88.62,78.18 88.62,79.2 88.62,80.21 88.62,81.23 88.62,82.25 88.62,76.15 57.18,15.27 59.72,15.21 62.26,15.21 64.77,15.19 67.31,15.24 69.85,15.19 60,51.4 55,52.2 65,60 29.4,81.4 13.6,70.6 28,68.8 45.6,51 78.8,73.6 41.8,80.6 79.8,85.4
  pour Top: 92.52,-5.29 92.52,98.21 -4.78,98.21 -4.78,-5.29
  pour Bottom: -5.78,98.91 -5.78,-6.19 93.22,-6.19 93.22,98.91
  pour Route2: 93.4,98.2 0.6,98.2 -3,98.2 -3,-5.8 93.4,-5.8
  pour Route15: 91.4,97 -3.8,97 -3.8,-3.2 91.4,-3.2
GND2  (via drill 2.25 pad 4)
  other vias: 53.8,43.65
GPIO1_0
  Bottom 0.305: J12.1 48.88,10.38 48.88,11.19 48.2,11.87 48.2,17.4 47.2,18.4 40.2,18.4 39.37,17.57 P8.25
GPIO1_1
  Bottom 0.305: J12.4 45.88,10.38 45.88,11.19 44.73,12.34 43.54,12.34 P8.24
GPIO1_4
  Bottom 0.305: J12.2 47.88,10.38 47.88,11.19 47.71,11.37 47.63,11.37 45.8,13.2 45.8,17.4 45.26,17.94 43.34,17.94 P8.23
GPIO1_16
  Bottom 0.305: U2.15 38.48,53.52 37.4,54.6 37.4,58.8 39.2,60.6 50.4,60.6 50.8,61 50.8,63.8 51.77,64.77 P9.15
GPIO1_17  (via drill 0.35)
  Route15 0.305: v33.2,51.4 40.4,51.4 43.2,54.2 43.2,58.8 40.6,61.4 40.6,63.46 P9.23
  Bottom 0.305: U2.1 33.79,51.99 v33.2,51.4
GPIO1_28
  Bottom 0.305: P9.12 55.98,63.4 55.98,66.62 54.2,68.4 47.4,68.4 45.8,66.8 45.8,62.06 44.8,61.06 39.01,61.06 36.94,58.99 36.94,54.21 38.28,52.87 U2.16
GPIO1_29
  Bottom 0.305: J12.5 44.88,10.38 44.88,11.19 44.27,11.8 41.54,11.8 P8.26
GPIO2_6
  Bottom 0.305: J10.5 20.8,29.6 13.97,22.77 P8.45
GPIO2_7
  Bottom 0.305: J10.4 29.2,28.6 21,28.6 15.2,22.8 15.2,18.72 15.24,18.68 15.24,16.28 13.97,15.01 P8.46
GPIO2_8
  Bottom 0.305: J10.3 21.2,27.6 16.51,22.91 P8.43
GPIO2_9
  Bottom 0.305: J10.2 21.6,26.6 17.78,22.78 17.78,15.98 16.51,14.71 P8.44
GPIO2_10
  Bottom 0.305: J10.1 21.8,25.6 19.05,22.85 P8.41
GPIO2_11
  Bottom 0.305: J11.1 18.4,13.32 P8.42
GPIO2_12
  Bottom 0.305: P8.39 20.28,15.2 18.6,15.2 17.77,14.37 17.77,13.73 17.4,13.36 J11.2
GPIO2_13
  Bottom 0.305: J11.3 16.4,10.2 17.2,9.4 18.6,9.4 21.59,12.39 P8.40
GPIO2_22
  Bottom 0.305: J12.3 46.88,10.38 46.88,11.19 45.27,12.8 43.8,12.8 43.2,13.4 43.2,14.2 42.2,15.2 38,15.2 36.83,16.37 P8.27
GPIO2_23
  Bottom 0.305: P8.29 34.29,15.47 33.23,14.41 33.23,13.53 33.85,12.91 33.89,12.91 37.4,9.4 37.4,5.61 36.59,4.8 35,4.8 33.4,3.2 16.8,3.2 15.2,4.8 15.2,10.26 J11.4
GPIO2_24
  Bottom 0.305: J12.6 40.73,10.37 39.97,9.6 38.65,9.6 36.82,11.42 P8.28
GPIO2_25
  Bottom 0.305: P8.30 34.29,13.31 38,9.6 38,5.35 36.8,4.15 35.52,4.15 33.97,2.6 16.4,2.6 14.4,4.6 J11.5
GPIO3_21  (via drill 0.35)
  Route15 0.305: v31.4,52.6 31.4,57.6 33,59.2 36.2,59.2 38,61 38,62.8 39.37,64.17 P9.25
  Bottom 0.305: U2.2 32.32,53.52 v31.4,52.6
GPIO17  (via drill 0.35)
  Top 0.305: JP6.1 79.3,50.9 v75.8,54.4 | v30.4,68.6 31.2,69.4 32.36,69.4 X1.11
  Route2 0.305: v75.8,54.4 58.8,54.4 54.68,50.28 53.32,50.28 53.03,50 30.4,50 28.9,51.5 28.9,58.9 30.4,60.4 v30.4,68.6
GPIO22
  Top 0.305: JP6.4 84.5,53.9 87,56.4 87,80 80,87 41.4,87 40.6,86.2 40.6,79.4 40,78.8 40,71.96 X1.15
GPIO23
  Top 0.305: JP6.3 84.3,52.9 87.6,56.2 87.6,80.2 78.34,89.46 38.88,89.46 38.18,88.76 38.18,77.86 X1.16
GPIO24
  Top 0.305: JP6.5 83.7,54.9 86.4,57.6 86.4,79.6 81.47,84.53 43.93,84.53 43.1,83.7 43.1,79.43 41.22,77.54 X1.18
GPIO25
  Top 0.305: JP6.6 83.56,55.9 85.94,58.28 85.94,77.26 83.8,79.4 48.35,79.4 X1.22
GPIO27  (via drill 0.35)
  Top 0.305: JP6.2 80.5,51.9 v78,54.4 | v38,68.6 37.6,68.6 36.14,70.06 X1.13
  Route2 0.305: v78,54.4 73.4,59 39.2,59 38,60.2 v38,68.6
I2C1_SCL  (via drill 0.35)
  Top 0.305: v50.4,69.2 50.4,68.2 v51,67.6
  Bottom 0.305: v50.4,69.2 63.4,69.2 65.2,71 65.2,76.78 67.31,78.89 H1.1.43 | v51,67.6 51,66.24 P9.17
I2C1_SDA  (via drill 0.35)
  Top 0.305: v48.4,69.2 48.4,68.2 v47.8,67.6
  Bottom 0.305: v48.4,69.2 49.2,70 61.4,70 62.6,71.2 62.6,76.6 64.77,78.77 H1.1.41 | v47.8,67.6 48.4,67 48.4,63.36 P9.18
I2C2_SCL  (via drill 0.35)
  Top 0.305: P9.19 48.62,66.4 57.2,66.4 58.63,64.97 58.63,61.79 58.8,61.62 58.8,35.4 41.6,18.2 34,18.2 32.81,17.01 32.81,13.53 32.8,13.52 v32.8,12.4
  Bottom 0.305: v32.8,12.4 32.4,12 31.4,12 30.9,11.5 J8.3
I2C2_SDA  (via drill 0.35)
  Top 0.305: P9.20 48.16,63.4 55,63.4 56,62.4 56,60.2 58.2,58 58.2,35.8 41.4,19 32,19 30.4,17.4 v30.4,12.6
  Bottom 0.305: v30.4,12.6 29.9,12.1 J8.4
N$1  (via drill 2.25 pad 4)
  other vias: 41.3,43.65
N$2  (via drill 2.8 pad 6)
  other vias: 16.03,51
N$3  (via drill 2.25 pad 4)
  other vias: 41.3,22.62
N$4  (via drill 2.25 pad 4)
  other vias: 53.8,22.65
N$5  (via drill 3.17 pad 5.08)
  other vias: 74.96,15.29
N$6  (via drill 3.17 pad 5.08)
  other vias: 74.96,63.55
N$7  (via drill 3.17 pad 5.08)
  other vias: 8.92,18.34
N$8  (via drill 3.17 pad 5.08)
  other vias: 8.92,60.37
N$9  (via drill 2.8 pad 6)
  other vias: 16.03,74
N$10  (via drill 2.8 pad 6)
  other vias: 74.03,51
N$11  (via drill 2.8 pad 6)
  other vias: 74.03,74
N$12  (via drill 0.35)
  other vias: 40.2,12
N$13  (via drill 0.35)
  other vias: 40.2,10.8
N$94
  Top 1.27: H1.P$4 8.91,85.99 R66.1
RPI_5V_PWR_IN  (via drill 0.35)
  Top 0.61: v14.6,77.8 20.45,77.8 X1.2
  Route15 0.61: v34.4,45.6 30.2,45.6 16.2,59.6 13.4,59.6 12,61 12,75.2 v14.6,77.8
  Bottom 0.305: U4.8 42.99,36.91
  Bottom 0.61: U4.1 U4.8 | 42.99,36.91 C2.1 34.4,45.5 v34.4,45.6
RPI_ENABLE  (via drill 0.35)
  Route15 0.305: v48.4,31.6 48.4,29.6 51.6,26.4 58.6,26.4 62.2,22.8 62.2,22 62.2,21.8 62.2,16.54 P8.7
  Bottom 0.305: U4.4 48.05,31.95 v48.4,31.6
RX+
  Bottom 0.305: J1.3 J2.2
RX-
  Bottom 0.305: J2.1 J1.4
S1
  Bottom 0.305: U2.4 31.6,54.82 30.4,53.62 30.4,42 53,19.4 62.4,19.4 63.6,18.2 63.6,11.54 J14.1
S2
  Bottom 0.305: U2.5 31.33,55.47 29.75,53.89 29.75,41.73 53.57,17.91 59.89,17.91 61.17,16.63 61.17,13.53 61.5,13.2 J14.2
S3
  Bottom 0.305: U2.6 31.06,56.12 29.1,54.16 29.1,41.46 53.55,17.01 53.55,13.53 54.28,12.8 59.8,12.8 60.5,12.1 J14.3
S4
  Bottom 0.305: U2.7 30.79,56.77 28.45,54.43 28.45,41.19 51.01,18.63 51.01,13.53 52.34,12.2 59,12.2 59.5,11.7 J14.4
S5
  Bottom 0.305: U2.12 41.29,55.47 41.67,55.09 41.67,47.78 71.4,18.04 71.4,11.94 J15.4
S6
  Bottom 0.305: U2.11 41.55,56.12 42.32,55.36 42.32,48.05 72,18.36 72,12.54 73.48,11.06 73.48,10.86 J15.3
S7
  Bottom 0.305: U2.10 41.82,56.77 42.97,55.63 42.97,48.31 70.64,20.64 70.74,20.54 73.15,18.13 76.14,18.13 77.81,16.47 77.81,14.11 74.9,11.2 J15.2
S8
  Bottom 0.305: U2.9 42.09,57.42 43.62,55.9 43.62,48.58 71.1,21.1 71.2,21 73.61,18.59 76.33,18.59 78.26,16.66 78.26,13.92 75.9,11.56 J15.1
SCL1_I2C  (via drill 0.35)
  Top 0.305: JP5.2 16.3,41.1 v17.8,42.6 | v25.4,68.6 25.98,69.18 X1.5
  Route2 0.305: v17.8,42.6 17.8,46.8 25.4,54.4 v25.4,68.6
SDA1_I2C  (via drill 0.35)
  Top 0.305: JP5.1 15.1,42.1 v15.6,42.6 15.6,46.6 10.2,52 10.2,56.8 12.4,59 12.4,66.6 15.2,69.4 22.2,69.4 X1.3
SPI0_CE0_N
  Top 0.305: JP7.3 83.5,66.9 85.4,68.8 85.4,77.15 83.78,78.78 49.58,78.78 48.84,78.04 X1.24
SPI0_CE1_N
  Top 0.305: JP7.5 80.63,68.9 77.8,71.73 77.8,75.2 75.4,77.6 72.4,77.6 70.6,75.8 70.6,75.21 69.56,74.17 53.52,74.17 52.44,75.25 52.44,76.29 X1.26
SPI0_MISO  (via drill 0.35)
  Top 0.305: JP7.2 79.7,65.9 v78.8,66.8 | X1.21 46.3,68.5 v46.2,68.4
  Route2 0.305: v78.8,66.8 77.2,68.4 v46.2,68.4
SPI0_MOSI  (via drill 0.35)
  Top 0.305: JP7.1 78.5,64.9 v76.6,66.8 | X1.19 43.8,70.6 v43.8,68.6
  Route2 0.305: v76.6,66.8 45.6,66.8 v43.8,68.6
SPI0_SCLK
  Top 0.305: JP7.4 52.27,67.9 51.28,66.92 50.72,66.92 49.08,68.55 49.08,70.64 X1.23
SPI1_CS0  (via drill 0.35)
  Top 0.305: v35.4,68.6 35.4,66.6 v35.6,66.4 | v27.8,81.6 28.2,81.2 v28.2,79.2 | v51.6,51.6 51.6,55 47,59.6 38.4,59.6 36.8,61.2 36.8,62.2 P9.28
  Bottom 0.305: U3.1 62.02,50.17 63,49.2 63,48.6 61.2,46.8 53,46.8 51.57,48.23 51.57,51.57 v51.6,51.6 51.6,52.78 U1.4 | H1.1.10 25.41,87 27.2,87 27.92,86.28 27.92,81.72 v27.8,81.6 | v28.2,79.2 30,77.4 33.6,77.4 35,76 35,69 v35.4,68.6 | v35.6,66.4 35.6,63.46 P9.28
SPI1_D0  (via drill 0.35)
  Top 0.305: v34.2,68.6 v34.2,66.4 | v26.6,81.6 27,81.2 v27,79.2 | v53.4,55.8 48.2,61 41.6,61 40.6,62 40.6,65.04 39.81,65.83 36.39,65.83 35.33,64.77 P9.29
  Bottom 0.305: H1.1.11 26.47,83.02 26.47,81.73 v26.6,81.6 | v27,79.2 29.6,76.6 31.4,76.6 32.4,75.6 32.4,71.4 34.2,69.6 v34.2,68.6 | v34.2,66.4 34.2,64.86 P9.29 | U3.7 55.06,49.52 54.14,50.45 54.14,55.2 53.54,55.8 v53.4,55.8 52.01,55.8 U1.2
SPI1_D1  (via drill 0.35)
  Top 0.305: v32.8,68.6 v32.8,66.4 | v25.2,81.6 25.6,81.2 v25.6,79.2 | v53.6,49.6 52.4,49.6 49.8,52.2 49.8,55.8 46.6,59 37.52,59 P9.30
  Bottom 0.305: U3.6 54.33,48.88 v53.6,49.6 53,50.2 53,53.4 52.31,54.09 U1.3 | H1.1.12 25.4,84.45 25.4,81.8 v25.2,81.6 | v25.6,79.2 28.47,76.33 28.96,76.33 30,75.28 30,71.2 30.8,70.4 32,70.4 32.8,69.6 v32.8,68.6 | v32.8,66.4 32.8,65.22 32.81,65.21 32.81,63.71 P9.30
SPI1_SCLK  (via drill 0.35)
  Top 0.305: v31.6,68.6 v31.6,66.4 | v24,81.6 24.4,81.2 v24.4,79.2 | v55.2,53.8 54.2,54.8 53,54.8 47.46,60.34 38.66,60.34 38,61 38,62.8 37.4,63.4 33.12,63.4 P9.31
  Bottom 0.305: H1.1.9 23.93,83.02 23.93,81.67 v24,81.6 | v24.4,79.2 27.4,76.2 27.4,71.6 29.6,69.4 30.8,69.4 v31.6,68.6 | v31.6,66.4 31.6,64.92 P9.31 | U1.1 53.77,56.63 55.2,55.2 v55.2,53.8 56.02,52.98 U3.8
TX+
  Bottom 0.305: J1.1 J2.4
TX-
  Bottom 0.305: J2.3 J1.2
U11_CT
  Bottom 0.305: U1.6 46.02,54 45.2,54 44.07,52.87 44.07,48.77 46.5,46.34 61.39,46.34 63.66,48.61 63.66,49.79 57.6,55.85 57.6,55.98 R2.1
U11_INT
  Bottom 0.305: U1.5 47.98,52.82 49,53.83 49,55.8 50.5,57.3 54.5,57.3 55,56.8 59.22,56.8 R3.1
UART1_RXD
  Bottom 0.305: P9.26 38,63.6 38,65.8 36.6,67.2 11.4,67.2 10.2,68.4 10.2,73.6 11.04,74.44 J6.1
UART1_TXD
  Bottom 0.305: P9.24 41.51,62.63 41.51,63.63 40.63,64.51 40.63,65.41 38.24,67.8 12.6,67.8 11.2,69.2 11.2,73.4 12.4,74.6 12.4,78.2 11.5,79.1 J6.2
UART2_RXD  (via drill 0.35)
  Top 0.305: v29.4,79.2 29.4,78.23 X1.8
  Route2 0.305: P9.22 43.28,63.4 41.6,63.4 40.8,64.2 40.8,66.6 40.8,67 40.8,67.8 37.4,71.2 37.4,76 34.2,79.2 v29.4,79.2
UART2_TXD  (via drill 0.35)
  Top 0.305: v36.8,79.4 33.11,79.4 X1.10
  Route2 0.305: P9.21 44.45,65.37 42.61,67.21 42.61,76.19 39.4,79.4 v36.8,79.4
UART4_RXD
  Route15 0.305: P9.11 55.2,66.72 55.2,77.2 53.2,79.2 40.2,79.2 39.2,80.2 32.2,80.2 30.6,81.8 30.6,86.4 30,87 12.8,87 12.2,86.4 12.2,84.4 13.41,83.19 H1.1.1
UART4_TXD
  Route15 0.305: P9.13 52.6,66.78 52.6,76.6 51.8,77.4 32.6,77.4 29.6,80.4 23.8,80.4 22.8,81.4 22.8,84 22.4,84.4 15.29,84.4 H1.1.2
UART5_RXD
  Bottom 0.305: J8.6 24.5,13.97 P8.38
UART5_TXD
  Bottom 0.305: J8.5 28.9,12.3 28,13.2 28,14.4 27.2,15.2 25.4,15.2 24.13,16.47 P8.37
VCC_HOST  (via drill 0.35)
  Top 0.406: JP1.1 76.9,36.9 67.6,46.2 67.6,53.8 71.4,57.6 v79.2,57.6
  Bottom 0.406: J5.4 79.3,57.5 v79.2,57.6
VCC_MICRO
  Bottom 0.406: J3.1 J4.4

### Text on the board
tPlace: Raspberry Pi Zero | RPI Zero Camera
tNames: OBC Board Rev. 1.0 / SN: ______________